# Altium project PCB_Project.PrjPcb
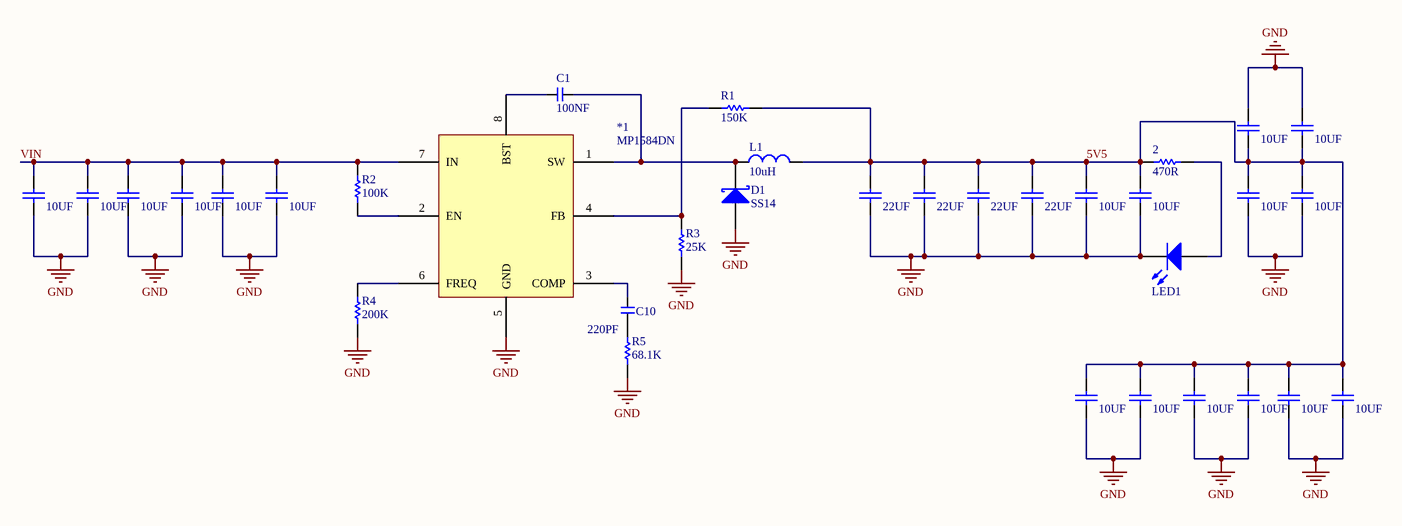
[diagram p0: MP1584DN.SchDoc]
1 sheet, 34 parts. Net scope: global (net labels, ports and power ports of the same name join across sheets).
Board file: MP1584s.PcbDoc

## Sheet MP1584DN.SchDoc
size A4

### Parts
1  10UF  [LC-1206_C]
2  470R  [R-0603]
3  10UF  [LC-1206_C]
4  10UF  [LC-1206_C]
5  10UF  [LC-1206_C]
6  22UF  [C-0805]
7  22UF  [C-0805]
8  10UF  [LC-1206_C]
9  10UF  [LC-1206_C]
10  10UF  [LC-1206_C]
11  10UF  [LC-1206_C]
12  10UF  [LC-1206_C]
*1  MP1584DN  [LC-SOIC-8_EP_150mil]
C1  100NF  [CAPC1608L]
C2  10UF  [LC-1206_C]
C3  10UF  [LC-1206_C]
C4  10UF  [LC-1206_C]
C5  10UF  [LC-1206_C]
C6  22UF  [C-0805]
C7  22UF  [C-0805]
C8  10UF  [LC-1206_C]
C9  10UF  [LC-1206_C]
C10  220PF  [CAPC1608L]
C11  10UF  [LC-1206_C]
C12  10UF  [LC-1206_C]
C13  10UF  [LC-1206_C]
D1  Type: SS14  [DIODE-SMA]  (hidden comment: D-Schottky)
L1  value 10uH  [L-SMD-7]  (hidden comment: Inductor)
LED1  red  [L-0603]  (value not drawn)
R1  150K  [R-0603]
R2  100K  [R-0603]
R3  25K  [R-0603]
R4  200K  [R-0603]
R5  68.1K  [R-0603]

### Nets
GND: 1.1 3.1 4.1 5.1 6.1 7.1 8.1 9.1 10.1 11.1 12.1 *1.5(GND) C2.1 C3.1 C4.1 C5.1 C6.1 C7.1 C8.1 C9.1 C11.1 C12.1 C13.1 D1.1(A) LED1.2(K) R3.1 R4.1 R5.1
5V5: 1.2 2.2 6.2 7.2 8.2 9.2 10.2 11.2 12.2 C2.2 C6.2 C7.2 C8.2 C9.2 C11.2 C12.2 C13.2 L1.2 R1.1
VIN: 3.2 4.2 5.2 *1.7(IN) C3.2 C4.2 C5.2 R2.2
Net2_1: 2.1 LED1.1(A)
Net*1_1: *1.1(SW) C1.1 D1.2(K) L1.1
Net*1_2: *1.2(EN) R2.1
Net*1_3: *1.3(COMP) C10.2
Net*1_4: *1.4(FB) R1.2 R3.2
Net*1_6: *1.6(FREQ) R4.2
Net*1_8: *1.8(BST) C1.2
NetC10_1: C10.1 R5.2

### Library data of the parts
1 3-12 C2-C9 C11-C13 = CAP: Capacitor; Value: 100nF; Published: 8-Jun-2000; Revision: July-2002: Re-released for DXP Platform.; Publisher: Altium Limited
2 R1-R5 = RES: Resistor; Value: 1K; Published: 8-Jun-2000; Revision: July-2002: Re-released for DXP Platform.; Publisher: Altium Limited
C1 C10 = C0603-100nF/50V: X7R; Value: 100nF,50V
D1 = D-Schottky: 肖特基二极管; Published: 8-Jun-2000; LatestRevisionDate: 17-Jul-2002; LatestRevisionNote: Re-released for DXP Platform.; PackageReference: SMB; Publisher: Altium Limited; Code_JEDEC: DO-214-AA
L1 = Inductor_2: 电感; Code_IEC: 1005; Published: 8-Jun-2000; LatestRevisionDate: 17-Jul-2002; LatestRevisionNote: Re-released for DXP Platform.; PackageReference: 0402-A; Publisher: Altium Limited; Code_JEITA: 0402
LED1 = LED: Typical RED, GREEN, YELLOW, AMBER GaAs LED; Published: 8-Jun-2000; Revision: July-2002: Re-released for DXP Platform.; Publisher: Altium Limited